# Altium project ts_20-Trolley-Discharge-Module.PrjPcb
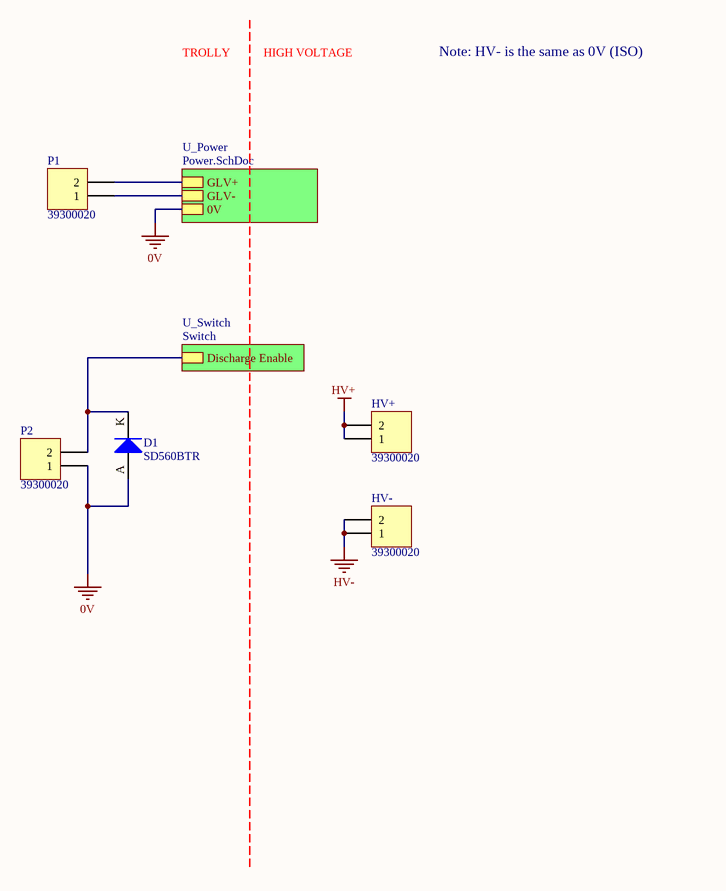
[diagram p0: Top Level.SchDoc]
3 sheets, 42 parts. Net scope: hierarchical (ports join the sheet entries above them; power ports are global).
Board file: PCB.PcbDoc
Sheets:
  Top Level.SchDoc
    U_Switch = Switch.SchDoc
    U_Power = Power.SchDoc

## Sheet Top Level.SchDoc
size A

### Parts
D1  SD560BTR  [SMB Diode]
HV+  39300020  [39300020]
HV-  39300020  [39300020]
P1  39300020  [39300020]
P2  39300020  [39300020]

### Sub-sheets
U_Power = Power.SchDoc: GLV+, GLV-, 0V
U_Switch = Switch: Discharge Enable

### Nets
0V: D1.A P1.1 P2.1 ; sheet U_Power/GLV-, sheet U_Power/0V
HV+: HV+.1 HV+.2
HV-: HV-.1 HV-.2
NetD1_K: D1.K P2.2 ; sheet U_Switch/Discharge Enable
NetF1_1: P1.2 ; sheet U_Power/GLV+

### Notes on the sheet
- TROLLY
- HIGH VOLTAGE
- Note: HV- is the same as 0V (ISO)

### Library data of the parts
D1 = SD560BTR: 1.2V_F 600V 5A SMB; Manufacturer: SMC Diode Solutions; Part Number: SD560BTR; Digikey Part Number: 1655-1530-2-ND; Digikey Link: https://www.digikey.com/product-detail/en/smc-diode-solutions/SD560BTR/1655-1530-2-ND/6022620
HV+ HV- P1 P2 = 39300020: Pitch: 4.2mm; Row Spacing: 5.5mm; Angle: 90; Flange: No; Contact: Tin; Part Number: 39300020; Positions: 2; Digikey Part Number: WM21351-ND

## Sheet Switch.SchDoc
size A
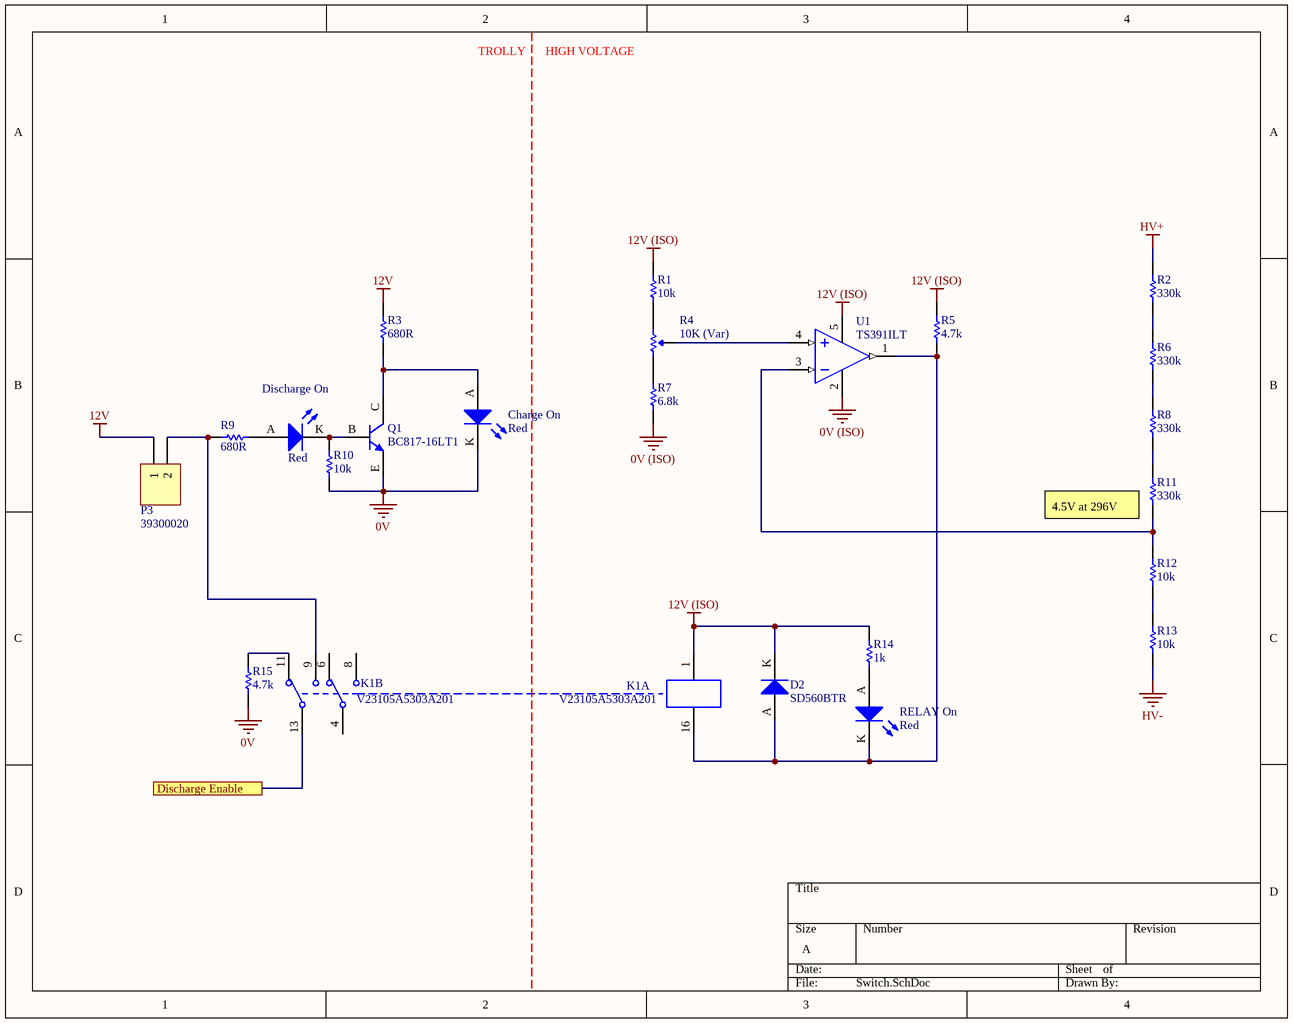
[diagram p1: Switch.SchDoc]

### Parts
Charge_On  Red  [0805 LED]
D2  SD560BTR  [SMB Diode]
Discharge_On  Red  [0805 LED]
K1  V23105A5303A201  [TI 2-DIL]  (parts A,B of 2)
P3  39300020  [39300020]
Q1  BC817-16LT1  [ON SOT-23 BJT]
R1  10k  [0805]
R2  330k  [0805]
R3  680R  [0805]
R4  10K (Var)  [B 3296]
R5  4.7k  [0805]
R6  330k  [0805]
R7  6.8k  [0805]
R8  330k  [0805]
R9  680R  [0805]
R10  10k  [0805]
R11  330k  [0805]
R12  10k  [0805]
R13  10k  [0805]
R14  1k  [0805]
R15  4.7k  [0805]
RELAY_On  Red  [0805 LED]
U1  TS391ILT  [ON SOT-23-5]

### Ports
Discharge Enable

### Nets
0V: Charge_On.K Q1.E R10.1 R15.2
0V (ISO): R7.1 U1.2(VCC-)
12V: P3.1 R3.2
12V (ISO): D2.K K1.1 R1.2 R5.2 R14.2 U1.5(VCC+)
HV+: R2.2
HV-: R13.2
NetCharge_On_A: Charge_On.A Q1.C R3.1
NetD1_K: K1.13 ; port Discharge Enable
NetD2_A: D2.A K1.16 R5.1 RELAY_On.K U1.1(OUT)
NetDischarge_On_A: Discharge_On.A R9.1
NetDischarge_On_K: Discharge_On.K Q1.B R10.2
NetK1_9: K1.9 P3.2 R9.2
NetK1_11: K1.11 R15.1
NetR1_1: R1.1 R4.1(CCW)
NetR2_1: R2.1 R6.2
NetR4_2: R4.2(Wiper) U1.4(IIN+)
NetR4_3: R4.3(CW) R7.2
NetR6_1: R6.1 R8.2
NetR8_1: R8.1 R11.2
NetR11_1: R11.1 R12.1 U1.3(IN-)
NetR12_2: R12.2 R13.1
NetR14_1: R14.1 RELAY_On.A

Not connected (* = marked no-connect by the designer): K1 4 6 8

### Notes on the sheet
- TROLLY
- HIGH VOLTAGE
- (near R11) 4.5V at 296V

### Library data of the parts
Charge_On Discharge_On RELAY_On = SML-210LTT86: Red LED Indication - Discrete 1.75V 0805 (2012 Metric); Manufacturer: ROHM Semiconductor; Part Number: SML-210LTT86; Colour: Red; Digikey Part Number: 511-1286-1-ND; Digikey Link: https://www.digikey.com/product-detail/en/rohm-semiconductor/SML-210LTT86/511-1286-1-ND/637099
D2 = SD560BTR: as D1 on sheet Top Level; Part Number: SD560BTR; Digikey Part Number: 1655-1530-2-ND; Digikey Link: https://www.digikey.com/product-detail/en/smc-diode-solutions/SD560BTR/1655-1530-2-ND/6022620
K1 = V23105A5303A201: RELAY TELECOM DPDT 3A 12V; Manufacturer: TE Connectivity; Part Number: V23105A5303A201; Digikey Part Number: PB387-ND; Digikey Link: https://www.digikey.com/product-detail/en/te-connectivity-potter-brumfield-relays/V23105A5303A201/PB387-ND/291023
P3 = 39300020: as HV+ on sheet Top Level; Part Number: 39300020; Positions: 2; Digikey Part Number: WM21351-ND
Q1 = BC817-16LT1: 300mW  BJT NPN Transistor; Manufacturer: ON Semiconductor; Part Number: BC817-16LT1; Digikey Part Number: BC817-16LT1OSTR-ND; Digikey Link: https://www.digikey.com.au/product-detail/en/on-semiconductor/BC817-16LT1/BC817-16LT1OSTR-ND/606178
R1 R10 R12 R13 = RC0805FR0710KL: Manufacturer: YAGEO; Tolerance: 0.01; Rated Voltage: 0.125W; Part Number: RC0805FR0710KL; Value: 10k; Material: FR-07; Digikey Part Number: 311-10.0KCRCT-ND
R2 R6 R8 R11 = RC0805FR07330KL: Manufacturer: YAGEO; Tolerance: 0.01; Rated Voltage: 0.125W; Part Number: RC0805FR07330KL; Value: 330k; Material: FR-07; Digikey Part Number: 311-330KCRCT-ND
R3 R9 = RC0805FR07680RL: Manufacturer: YAGEO; Tolerance: 0.01; Rated Voltage: 0.125W; Part Number: RC0805FR07680RL; Value: 680R; Material: FR-07; Digikey Part Number: 311-680CRCT-ND
R4 = 3296W-1-103LF: Manufacturer: Bournes Inc; Tolerance: 0.1; Rated Voltage: 0.5W; Part Number: 3296W-1-103LF; Value: 10K (Var); Digikey Part Number: 3296W-103LF-ND
R5 R15 = RC0805FR074K7L: Manufacturer: YAGEO; Tolerance: 0.01; Rated Voltage: 0.125W; Part Number: RC0805FR074K7L; Value: 4.7k; Material: FR-07; Digikey Part Number: 311-4.70KCRCT-ND
R7 = RC0805FR076K8L: Manufacturer: YAGEO; Tolerance: 0.01; Rated Voltage: 0.125W; Part Number: RC0805FR076K8L; Value: 6.8k; Material: FR-07; Digikey Part Number: 311-6.80KCRCT-ND
R14 = RC0805FR071KL: Manufacturer: YAGEO; Tolerance: 0.01; Rated Voltage: 0.125W; Part Number: RC0805FR071KL; Value: 1k; Material: FR-07; Digikey Part Number: 311-1.00KCRCT-ND
U1 = TS391ILT: IC COMP LO PWR SGL V SOT 23-5L; Manufacturer: STMicroelectronics; Part Number: TS391ILT; Digikey Part Number: 497-2275-2-ND; Digikey Link: https://www.digikey.com/product-detail/en/stmicroelectronics/TS391ILT/497-2275-2-ND/599407

## Sheet Power.SchDoc
size A
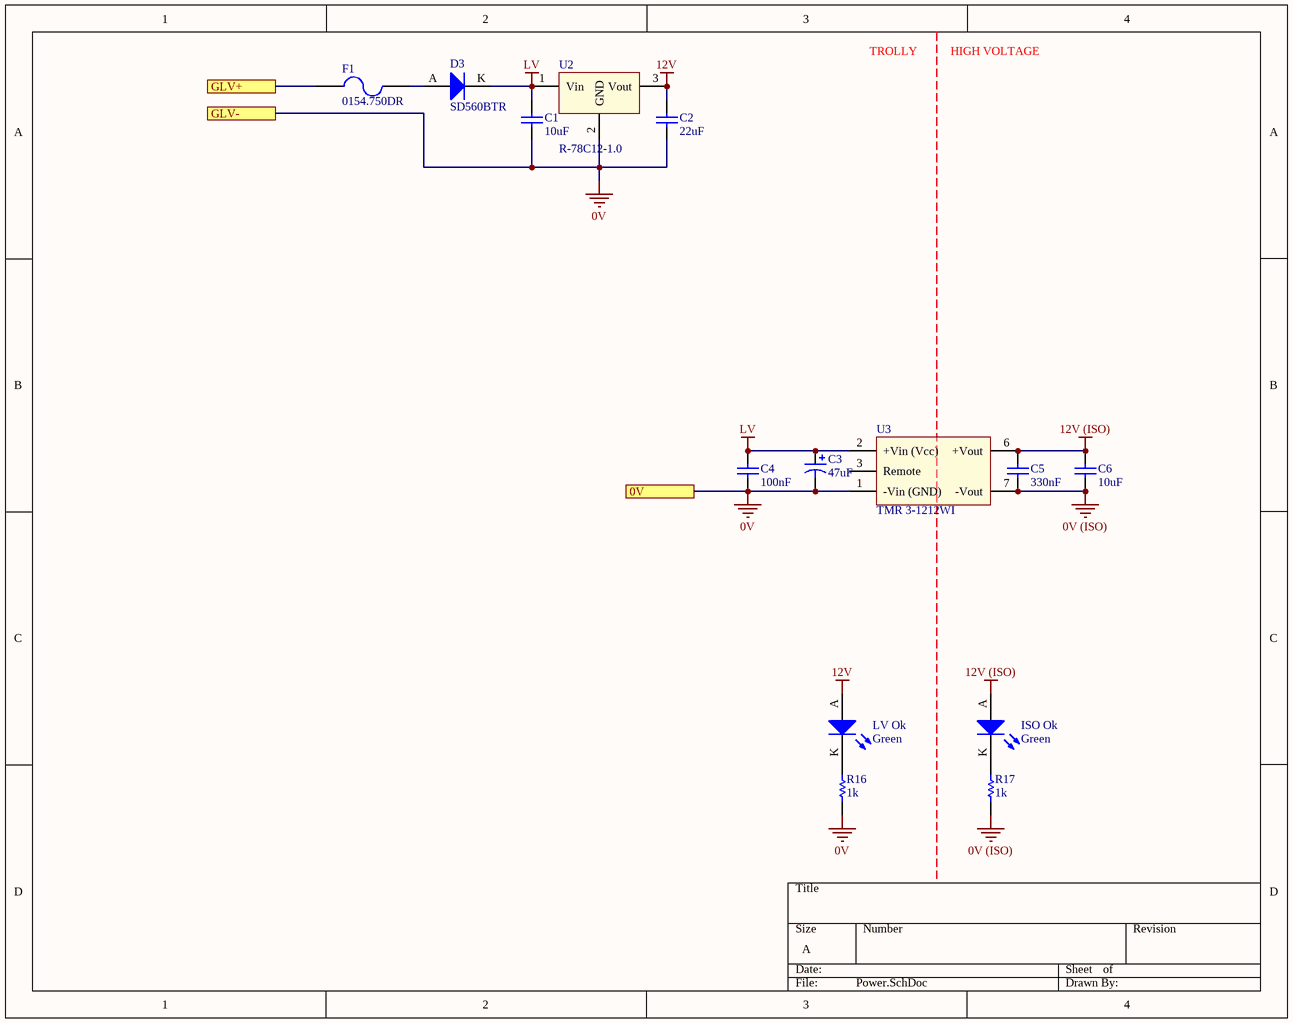
[diagram p2: Power.SchDoc]

### Parts
C1  10uF  [0805]
C2  22uF  [1206]
C3  47uF  [2924]
C4  100nF  [0805]
C5  330nF  [0805]
C6  10uF  [0805]
D3  SD560BTR  [SMB Diode]
F1  0154.750DR  [Omni BLOK 0154]
ISO_Ok  Green  [0805 LED]
LV_Ok  Green  [0805 LED]
R16  1k  [0805]
R17  1k  [0805]
U2  R-78C12-1.0  [RECOM 3-SIP]
U3  TMR 3-1212WI  [TRECO 8-SIP]

### Ports
0V, GLV+, GLV-

### Nets
0V: C1.1 C2.1 C3.1 C4.1 R16.1 U2.2(GND) U3.1(-Vin_(GND)) ; port GLV-, port 0V
0V (ISO): C5.1 C6.1 R17.1 U3.7(-Vout)
12V: C2.2 LV_Ok.A U2.3(Vout)
12V (ISO): C5.2 C6.2 ISO_Ok.A U3.6(+Vout)
LV: C1.2 C3.2 C4.2 D3.K U2.1(Vin) U3.2(+Vin_(Vcc))
NetD3_A: D3.A F1.2
NetF1_1: F1.1 ; port GLV+
NetISO_Ok_K: ISO_Ok.K R17.2
NetLV_Ok_K: LV_Ok.K R16.2

Not connected (* = marked no-connect by the designer): U3 3(Remote)

### Notes on the sheet
- TROLLY
- HIGH VOLTAGE

### Library data of the parts
C1 C6 = GRM21BR6YA106KE43L: Manufacturer: muRata; Tolerance: 10%; Material: X5R; Rated Voltage: 50V; Part Number: GRM21BR6YA106KE43L; Value: 10uF; Digikey Part Number: 490-10514-6-ND
C2 = CC1206MKX5R7BB226: Manufacturer: YAGEO; Tolerance: 20%; Material: Ceramic; Rated Voltage: 16V; Part Number: CC1206MKX5R7BB226; Value: 22uF; Digikey Part Number: 311-1997-2-ND
C3 = TAJV476K035RNJ: Manufacturer: AVX Corporation; Tolerance: 10%; Material: Tantalum; Rated Voltage: 35V; Part Number: TAJV476K035RNJ; Value: 47uF; Digikey Part Number: 478-8934-1-ND
C4 = GCM21BR71H104KA37L: Manufacturer: muRata; Tolerance: ±10%; Material: X7R; Rated Voltage: 50V; Part Number: GCM21BR71H104KA37L; Value: 100nF; Digikey Part Number: 490-6064-1-ND
C5 = GCM219R71H334KA55D: Manufacturer: muRata; Tolerance: ±10%; Material: X7R; Rated Voltage: 50V; Part Number: GCM219R71H334KA55D; Value: 330nF; Digikey Part Number: 490-8045-1-ND
D3 = SD560BTR: as D1 on sheet Top Level; Part Number: SD560BTR; Digikey Part Number: 1655-1530-2-ND; Digikey Link: https://www.digikey.com/product-detail/en/smc-diode-solutions/SD560BTR/1655-1530-2-ND/6022620
F1 = 0154.750DR: FUSE BOARD MNT 750MA 125VAC/VDC; Manufacturer: LittelFuse Inc; Part Number: 0154.750DR; Digikey Part Number: F1221CT-ND; Digikey Link: https://www.digikey.com/product-detail/en/littelfuse-inc/0154.750DR/F1221CT-ND/183370
ISO_Ok LV_Ok = SML-210FTT86: Green LED Indication - Discrete 1.75V 0805 (2012 Metric); Manufacturer: ROHM Semiconductor; Part Number: SML-210FTT86; Colour: Green; Digikey Part Number: 511-1285-1-ND; Digikey Link: https://www.digikey.com/product-detail/en/rohm-semiconductor/SML-210FTT86/511-1285-1-ND/637098
R16 R17 = RC0805FR071KL: as R14 on sheet Switch; Part Number: RC0805FR071KL; Value: 1k; Material: FR-07; Digikey Part Number: 311-1.00KCRCT-ND
U2 = R-78C12-1.0: 3PIN DC DC CONVERTER 12V 12W; Manufacturer: Recom; Isolation: Non-Isolated; Part Number: R-78C12-1.0; Digikey Part Number: 945-1392-5-ND; Digikey Link: https://www.digikey.com/products/en/power-supplies-board-mount/dc-dc-converters/922?k=R-78C&k=&pkeyword=R-78C&sv=0&pv1525=44&sf=0&FV=ffe0039a&quantity=&ColumnSort=0&page=1&pageSize=25
U3 = TMR 3-1212WI: DC DC CONVERTER 12V 3W; Manufacturer: Traco Power; Isolation: Isolated; Part Number: TMR 3-1212WI; Digikey Part Number: 1951-2367-ND; Digikey Link: https://www.digikey.com.au/product-detail/en/traco-power/TMR-3-1212WI/1951-2367-ND/9383402

## Nets that join several sheets
0V: Top Level (D1.A P1.1 P2.1), Switch (Charge_On.K Q1.E R10.1 R15.2), Power (7 pins)
0V (ISO): Switch (R7.1 U1.2), Power (C5.1 C6.1 R17.1 U3.7)
12V: Switch (P3.1 R3.2), Power (C2.2 LV_Ok.A U2.3)
12V (ISO): Switch (6 pins), Power (C5.2 C6.2 ISO_Ok.A U3.6)
HV+: Top Level (HV+.1 HV+.2), Switch (R2.2)
HV-: Top Level (HV-.1 HV-.2), Switch (R13.2)
NetD1_K: Top Level (D1.K P2.2), Switch (K1.13)
NetF1_1: Top Level (P1.2), Power (F1.1)